# Altium schematic sheet Gate Driver.SchDoc: H-Bridge Gate Driver
size A4; SheetNumber: 2; SheetTotal: 4
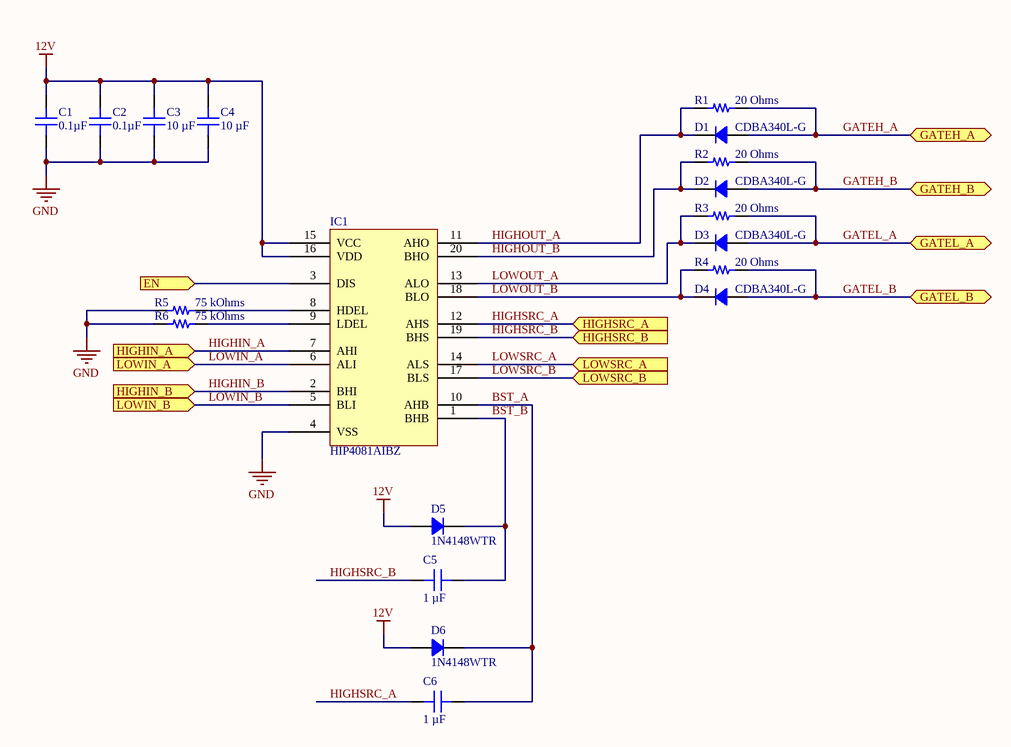
[diagram p0: Gate Driver.SchDoc]

## Parts
C1  0.1µF  [CAP 0603_1608]
C2  0.1µF  [CAP 0603_1608]
C3  10 µF  [CAP 1206_3216 - 0.8MM]
C4  10 µF  [CAP 1206_3216 - 0.8MM]
C5  1 µF  [CAP 0805_2012]
C6  1 µF  [CAP 0805_2012]
D1  CDBA340L-G  [DO214AC SMA]
D2  CDBA340L-G  [DO214AC SMA]
D3  CDBA340L-G  [DO214AC SMA]
D4  CDBA340L-G  [DO214AC SMA]
D5  1N4148WTR  [SOD-123]
D6  1N4148WTR  [SOD-123]
IC1  HIP4081AIBZ  [INTERSIL SOIC-20 WIDE]
R1  20 Ohms  [RES 0805_2012]
R2  20 Ohms  [RES 0805_2012]
R3  20 Ohms  [RES 0805_2012]
R4  20 Ohms  [RES 0805_2012]
R5  75 kOhms  [RES 0603_1608]
R6  75 kOhms  [RES 0603_1608]

## Ports
EN (in), GATEH_A (bidir), GATEH_B (bidir), GATEL_A (bidir), GATEL_B (bidir), HIGHIN_A (in), HIGHIN_B (in), HIGHSRC_A (in), HIGHSRC_B (in), LOWIN_A (in), LOWIN_B (in), LOWSRC_A (in), LOWSRC_B (in)

## Nets
12V: C1.2 C2.2 C3.2 C4.2 D5.1 D6.1 IC1.15(VCC) IC1.16(VDD)
GND: C1.1 C2.1 C3.1 C4.1 IC1.4(VSS) R5.1 R6.1
BST_A: C6.2 D6.2 IC1.10(AHB)
BST_B: C5.2 D5.2 IC1.1(BHB)
EN: IC1.3(DIS) ; port EN
GATEH_A: D1.1 R1.2 ; port GATEH_A
GATEH_B: D2.1 R2.2 ; port GATEH_B
GATEL_A: D3.1 R3.2 ; port GATEL_A
GATEL_B: D4.1 R4.2 ; port GATEL_B
HIGHIN_A: IC1.7(AHI) ; port HIGHIN_A
HIGHIN_B: IC1.2(BHI) ; port HIGHIN_B
HIGHOUT_A: D1.2 IC1.11(AHO) R1.1
HIGHOUT_B: D2.2 IC1.20(BHO) R2.1
HIGHSRC_A: C6.1 IC1.12(AHS) ; port HIGHSRC_A
HIGHSRC_B: C5.1 IC1.19(BHS) ; port HIGHSRC_B
LOWIN_A: IC1.6(ALI) ; port LOWIN_A
LOWIN_B: IC1.5(BLI) ; port LOWIN_B
LOWOUT_A: D3.2 IC1.13(ALO) R3.1
LOWOUT_B: D4.2 IC1.18(BLO) R4.1
LOWSRC_A: IC1.14(ALS) ; port LOWSRC_A
LOWSRC_B: IC1.17(BLS) ; port LOWSRC_B
NetIC1_8: IC1.8(HDEL) R5.2
NetIC1_9: IC1.9(LDEL) R6.2

## Notes on the sheet
- Title
- Size:
- Date:
- A4
- Number:
- Time:
- Revision:
- Sheet
- of
- File:

## Library data of the parts
C1 C2 = 06035C104MAT2A: CAP CER 0.1UF 50V X7R 0603; manufacturer: AVX Corporation; Tolerance: ±20%; Part Number: 06035C104MAT2A; Value: 0.1µF; Applications: General Purpose; Capacitance: 0.1µF; componentlink1description: Datasheet; componentlink1url: http://datasheets.avx.com/X7RDielectric.pdf; componentlink2description: DigiKey Link; componentlink2url: http://digikey.com/product-detail/en/avx-corporation/06035C104MAT2A/478-7928-1-ND/3881551; Device Package: 0603 (1608 Metric); lastupdated: 02/09/2020 01:03:35; Lifecycle Status: Active; Minimum Order: 1; Mounting Type: Surface Mount, MLCC; Operating Temperature: -55°C ~ 125°C; Package / Case: 0603 (1608 Metric); packaging: TapeAndReel; partid: 2734; Part Status: Active; price: 0.02; series: -; Size / Dimension: 0.063" L x 0.032" W (1.60mm x 0.81mm); Supplier 1: DigiKey; Supplier Part Number 1: 478-7928-1-ND; Temperature Coefficient: X7R; Thickness (Max): 0.035" (0.90mm); Voltage - Rated: 50V
C3 C4 = GRT31CR61H106ME01L: CAP CER 10UF 50V X5R 1206; manufacturer: Murata Electronics; Tolerance: ±20%; Part Number: GRT31CR61H106ME01L; Value: 10 µF; Applications: Automotive; Capacitance: 10 µF; componentlink1description: Datasheet; componentlink1url: https://search.murata.co.jp/Ceramy/image/img/A01X/G101/ENG/GRT31CR61H106ME01-01.pdf; componentlink2description: DigiKey Link; componentlink2url: https://www.digikey.com/en/products/detail/murata-electronics/GRT31CR61H106ME01L/5416879; Device Package: 1206 (3216 Metric); lastupdated: 04/03/2022 17:33:28; Lifecycle Status: Active; Minimum Order: 1; Mounting Type: Surface Mount, MLCC; Operating Temperature: -55°C ~ 85°C; Package / Case: 1206 (3216 Metric); packaging: TapeAndReel; partid: 22693; Part Status: Active; price: 0.09; Ratings: AEC-Q200; series: GRT; Size / Dimension: 0.126" L x 0.063" W (3.20mm x 1.60mm); Supplier 1: DigiKey; Supplier Part Number 1: 490-12457-1-ND; Temperature Coefficient: X5R; Thickness (Max): 0.071" (1.80mm); Voltage - Rated: 50V
C5 C6 = 08055C105KAZ2A: CAP CER 1UF 50V X7R 0805; manufacturer: KYOCERA AVX; Tolerance: ±10%; Part Number: 08055C105KAZ2A; Value: 1 µF; Applications: Boardflex Sensitive; Capacitance: 1 µF; componentlink1description: Datasheet; componentlink1url: https://datasheets.kyocera-avx.com/FlexitermMLCC.pdf; componentlink2description: DigiKey Link; componentlink2url: https://www.digikey.com/en/products/detail/kyocera-avx/08055C105KAZ2A/11568641; Device Package: 0805 (2012 Metric); Features: Soft Termination; lastupdated: 05/03/2022 16:50:45; Lifecycle Status: Active; Minimum Order: 1; Mounting Type: Surface Mount, MLCC; Operating Temperature: -55°C ~ 125°C; Package / Case: 0805 (2012 Metric); packaging: TapeAndReel; partid: 33480; Part Status: Active; price: 0.06; series: -; Size / Dimension: 0.079" L x 0.049" W (2.01mm x 1.25mm); Supplier 1: DigiKey; Supplier Part Number 1: 478-08055C105KAZ2ACT-ND; Temperature Coefficient: X7R; Thickness (Max): 0.055" (1.40mm); Voltage - Rated: 50V
D1-D4 = CDBA340L-G: DIODE SCHOTTKY 40V 3A DO214AC; Manufacturer: Comchip Technology; Current - Reverse Leakage @ Vr: 1.5 mA @ 40 V; Speed: Fast Recovery =< 500ns, > 200mA (Io); Voltage - Forward (Vf) (Max) @ If: 400 mV @ 3 A; Part Number: CDBA340L-G; ComponentLink1Description: Datasheet; ComponentLink1URL: http://www.comchiptech.com/admin/files/product/CDBA340L-HF%20RevC514368.pdf; ComponentLink2Description: DigiKey Link; ComponentLink2URL: https://www.digikey.com/en/products/detail/comchip-technology/CDBA340L-G/1249117; Current - Average Rectified (Io): 3A; Diode Type: Schottky; LastUpdated: 04/03/2022 18:07:12; Lifecycle Status: Active; Minimum Order: 1; Mounting Type: Surface Mount; Operating Temperature - Junction: 125°C (Max); Package / Case: DO-214AC, SMA; Packaging: TapeAndReel; PartId: 2091; Part Status: Active; Price: 0.20; Series: -; Supplier 1: DigiKey; Supplier Part Number 1: 641-1258-1-ND; Supplier Device Package: DO-214AC (SMA); Voltage - DC Reverse (Vr) (Max): 40 V
D5 D6 = 1N4148WTR: DIODE GEN PURP 75V 250MA SOD123; Manufacturer: SMC Diode Solutions; Capacitance @ Vr, F: 4pF @ 0V, 1MHz; Current - Average Rectified (Io): 250mA (DC); Current - Reverse Leakage @ Vr: 2.5 µA @ 75 V; Diode Type: Standard; Reverse Recovery Time (trr): 4 ns; Speed: Fast Recovery =< 500ns, > 200mA (Io); Voltage - Forward (Vf) (Max) @ If: 1.25 V @ 150 mA; Part Number: 1N4148WTR; ComponentLink1Description: Datasheet; ComponentLink1URL: http://www.smc-diodes.com/propdf/1N4148W%20N0571%20REV.D.pdf; ComponentLink2Description: DigiKey Link; ComponentLink2URL: https://www.digikey.com/en/products/detail/smc-diode-solutions/1N4148WTR/6022450; LastUpdated: 04/03/2022 18:07:21; Lifecycle Status: Active; Minimum Order: 1; Mounting Type: Surface Mount; Operating Temperature - Junction: -55°C ~ 150°C; Package / Case: SOD-123; Packaging: TapeAndReel; PartId: 1049; Part Status: Active; Price: 0.02; Series: -; Supplier 1: DigiKey; Supplier Part Number 1: 1655-1360-1-ND; Supplier Device Package: SOD-123; Voltage - DC Reverse (Vr) (Max): 75 V
IC1 = HIP4081AIBZ: IC GATE DRVR HALF-BRIDGE 20SOIC; Manufacturer: Renesas Electronics America Inc.; Channel Type: Independent; Current - Peak Output (Source, Sink): 2.6A, 2.4A; Gate Type: N-Channel MOSFET; High Side Voltage - Max (Bootstrap): 95V; Input Type: Non-Inverting; Logic Voltage - VIL, VIH: 1V, 2.5V; Number of Drivers: 4; Rise / Fall Time (Typ): 10ns, 10ns; Voltage - Supply: 9.5V ~ 15V; Part Number: HIP4081AIBZ; ComponentLink1Description: Datasheet; ComponentLink1URL: https://www.renesas.com/en-us/www/doc/datasheet/hip4081a.pdf; ComponentLink2Description: DigiKey Link; ComponentLink2URL: //digikey.com/product-detail/en/renesas-electronics-america-inc/HIP4081AIBZ/HIP4081AIBZ-ND/821444; Device Package: 20-SOIC (0.295", 7.50mm Width); Driven Configuration: Half-Bridge; LastUpdated: 12/12/2019 08:03:43; Lifecycle Status: 0; Minimum Order: 1; Mounting Type: Surface Mount; Operating Temperature: -40°C ~ 125°C (TJ); Package / Case: 20-SOIC (0.295", 7.50mm Width); Packaging: Tube; PartId: 4; Part Status: Active; Price: 5.41; Series: -; Supplier 1: DigiKey; Supplier Part Number 1: HIP4081AIBZ-ND; Supplier Device Package: 20-SOIC
R1-R4 = ERJ-6GEYJ200V: RES SMD 20 OHM 5% 1/8W 0805; Manufacturer: Panasonic Electronic Components; Power (Watts): 0.125W, 1/8W; Temperature Coefficient: ±200ppm/°C; Part Number: ERJ-6GEYJ200V; Value: 20 Ohms; ComponentLink1Description: Datasheet; ComponentLink1URL: http://industrial.panasonic.com/www-cgi/jvcr13pz.cgi?E+PZ+3+AOA0001+ERJ6GEYJ200V+7+WW; ComponentLink2Description: DigiKey Link; ComponentLink2URL: https://www.digikey.com/en/products/detail/panasonic-electronic-components/ERJ-6GEYJ200V/82980; Composition: Thick Film; Device Package: 0805 (2012 Metric); Features: Automotive AEC-Q200; Height - Seated (Max): 0.028" (0.70mm); LastUpdated: 05/03/2022 17:15:03; Lifecycle Status: Active; Minimum Order: 1; Number of Terminations: 2; Operating Temperature: -55°C ~ 155°C; Package / Case: 0805 (2012 Metric); Packaging: TapeAndReel; PartId: 47698; Part Status: Active; Price: 0.01; Ratings: AEC-Q200; Resistance: 20 Ohms; Series: ERJ-6G; Size / Dimension: 0.079" L x 0.049" W (2.00mm x 1.25mm); Supplier 1: DigiKey; Supplier Part Number 1: P20ACT-ND; Supplier Device Package: 0805; Tolerance: ±5%
R5 R6 = CRCW060375K0FKEAC: RES 75K OHM 1% 1/10W 0603; Manufacturer: Vishay Dale; Power (Watts): 0.1W, 1/10W; Temperature Coefficient: ±100ppm/°C; Part Number: CRCW060375K0FKEAC; Value: 75 kOhms; ComponentLink1Description: Datasheet; ComponentLink1URL: https://www.vishay.com/docs/28773/crcwce3.pdf; ComponentLink2Description: DigiKey Link; ComponentLink2URL: https://www.digikey.com/en/products/detail/vishay-dale/CRCW060375K0FKEAC/7924043; Composition: Thick Film; Device Package: 0603 (1608 Metric); Height - Seated (Max): 0.022" (0.55mm); LastUpdated: 04/03/2022 17:45:17; Lifecycle Status: Active; Minimum Order: 1; Number of Terminations: 2; Operating Temperature: -55°C ~ 155°C; Package / Case: 0603 (1608 Metric); Packaging: CutTape; PartId: 65787; Part Status: Active; Price: 0.01; Resistance: 75 kOhms; Series: CRCW-C; Size / Dimension: 0.063" L x 0.031" W (1.60mm x 0.80mm); Supplier 1: DigiKey; Supplier Part Number 1: 541-5552-1-ND; Supplier Device Package: 0603; Tolerance: ±1%